# Altium schematic sheet Decoup_Cap 1.SchDoc
size A
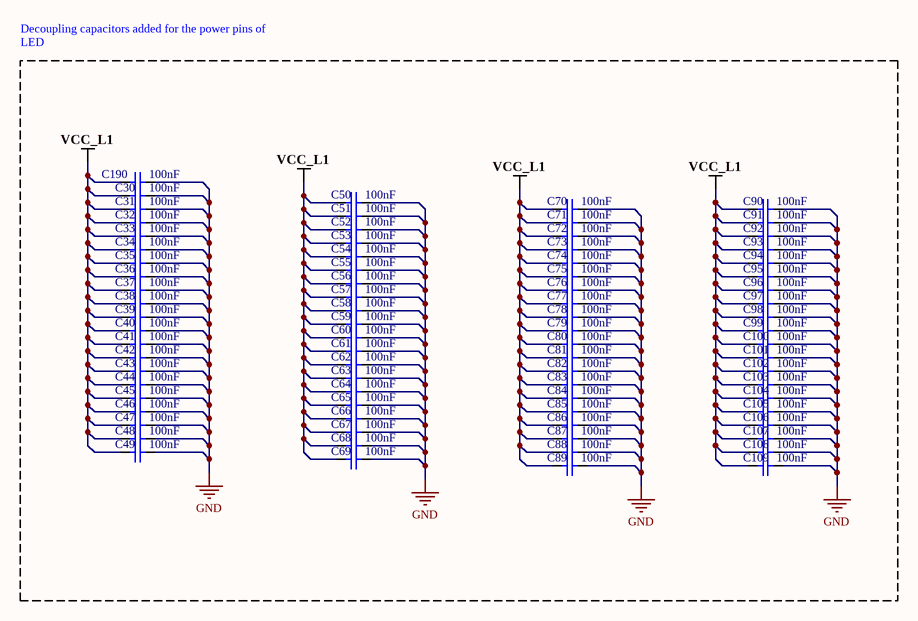
[diagram p0: Decoup_Cap 1.SchDoc]

## Parts
C30  100nF  [Cap0402]
C31  100nF  [Cap0402]
C32  100nF  [Cap0402]
C33  100nF  [Cap0402]
C34  100nF  [Cap0402]
C35  100nF  [Cap0402]
C36  100nF  [Cap0402]
C37  100nF  [Cap0402]
C38  100nF  [Cap0402]
C39  100nF  [Cap0402]
C40  100nF  [Cap0402]
C41  100nF  [Cap0402]
C42  100nF  [Cap0402]
C43  100nF  [Cap0402]
C44  100nF  [Cap0402]
C45  100nF  [Cap0402]
C46  100nF  [Cap0402]
C47  100nF  [Cap0402]
C48  100nF  [Cap0402]
C49  100nF  [Cap0402]
C50  100nF  [Cap0402]
C51  100nF  [Cap0402]
C52  100nF  [Cap0402]
C53  100nF  [Cap0402]
C54  100nF  [Cap0402]
C55  100nF  [Cap0402]
C56  100nF  [Cap0402]
C57  100nF  [Cap0402]
C58  100nF  [Cap0402]
C59  100nF  [Cap0402]
C60  100nF  [Cap0402]
C61  100nF  [Cap0402]
C62  100nF  [Cap0402]
C63  100nF  [Cap0402]
C64  100nF  [Cap0402]
C65  100nF  [Cap0402]
C66  100nF  [Cap0402]
C67  100nF  [Cap0402]
C68  100nF  [Cap0402]
C69  100nF  [Cap0402]
C70  100nF  [Cap0402]
C71  100nF  [Cap0402]
C72  100nF  [Cap0402]
C73  100nF  [Cap0402]
C74  100nF  [Cap0402]
C75  100nF  [Cap0402]
C76  100nF  [Cap0402]
C77  100nF  [Cap0402]
C78  100nF  [Cap0402]
C79  100nF  [Cap0402]
C80  100nF  [Cap0402]
C81  100nF  [Cap0402]
C82  100nF  [Cap0402]
C83  100nF  [Cap0402]
C84  100nF  [Cap0402]
C85  100nF  [Cap0402]
C86  100nF  [Cap0402]
C87  100nF  [Cap0402]
C88  100nF  [Cap0402]
C89  100nF  [Cap0402]
C90  100nF  [Cap0402]
C91  100nF  [Cap0402]
C92  100nF  [Cap0402]
C93  100nF  [Cap0402]
C94  100nF  [Cap0402]
C95  100nF  [Cap0402]
C96  100nF  [Cap0402]
C97  100nF  [Cap0402]
C98  100nF  [Cap0402]
C99  100nF  [Cap0402]
C100  100nF  [Cap0402]
C101  100nF  [Cap0402]
C102  100nF  [Cap0402]
C103  100nF  [Cap0402]
C104  100nF  [Cap0402]
C105  100nF  [Cap0402]
C106  100nF  [Cap0402]
C107  100nF  [Cap0402]
C108  100nF  [Cap0402]
C109  100nF  [Cap0402]
C190  100nF  [Cap0402]

## Nets
GND: C30.1 C31.1 C32.1 C33.1 C34.1 C35.1 C36.1 C37.1 C38.1 C39.1 C40.1 C41.1 C42.1 C43.1 C44.1 C45.1 C46.1 C47.1 C48.1 C49.1 C50.1 C51.1 C52.1 C53.1 C54.1 C55.1 C56.1 C57.1 C58.1 C59.1 C60.1 C61.1 C62.1 C63.1 C64.1 C65.1 C66.1 C67.1 C68.1 C69.1 C70.1 C71.1 C72.1 C73.1 C74.1 C75.1 C76.1 C77.1 C78.1 C79.1 C80.1 C81.1 C82.1 C83.1 C84.1 C85.1 C86.1 C87.1 C88.1 C89.1 C90.1 C91.1 C92.1 C93.1 C94.1 C95.1 C96.1 C97.1 C98.1 C99.1 C100.1 C101.1 C102.1 C103.1 C104.1 C105.1 C106.1 C107.1 C108.1 C109.1 C190.1
VCC_L1: C30.2 C31.2 C32.2 C33.2 C34.2 C35.2 C36.2 C37.2 C38.2 C39.2 C40.2 C41.2 C42.2 C43.2 C44.2 C45.2 C46.2 C47.2 C48.2 C49.2 C50.2 C51.2 C52.2 C53.2 C54.2 C55.2 C56.2 C57.2 C58.2 C59.2 C60.2 C61.2 C62.2 C63.2 C64.2 C65.2 C66.2 C67.2 C68.2 C69.2 C70.2 C71.2 C72.2 C73.2 C74.2 C75.2 C76.2 C77.2 C78.2 C79.2 C80.2 C81.2 C82.2 C83.2 C84.2 C85.2 C86.2 C87.2 C88.2 C89.2 C90.2 C91.2 C92.2 C93.2 C94.2 C95.2 C96.2 C97.2 C98.2 C99.2 C100.2 C101.2 C102.2 C103.2 C104.2 C105.2 C106.2 C107.2 C108.2 C109.2 C190.2

## Notes on the sheet
- Decoupling capacitors added for the power pins of LED

## Library data of the parts
C30-C109 C190 = CC0402KRX7R8BB104: CAP CER 0.1UF 25V X7R 0402; Manufacturer: Yageo; Tolerance: 10%; Dissipation Factor: 3.5%; Supplier 1: Digi-Key; Manufacturer Part Number: CC0402KRX7R8BB104; RoHS: Yes; Category: Ceramic Capacitors; Stock 1: 1841009; Pricing 1: 1=0.10000, 10=0.03100, 50=0.01700, 100=0.01390, 500=0.00990, 1000=0.00777, 2500=0.00707, 5000=0.00650 (USD); Mount: Surface Mount; Case/Package: 0402; Case Code (Imperial): 0402; Case Code (Metric): 1005; Min Operating Temperature: -55°C; Max Operating Temperature: 125°C; Capacitance: 100nF; Dielectric: X7R; Voltage Rating: 25V; Voltage Rating (DC): 25V; Packaging: Tape and Reel; Termination: SMD/SMT; Resistor Type: Ceramic; Length: 1mm; Width: 0.02inch; Height: 0.5mm; Thickness: 0.022inch; Depth: 0.5mm; Radiation Hardening: No; Lead Free: Lead Free; Halogen Free: Halogen Free; ComponentLink1URL: https://datasheet.ciiva.com/11464/upy-gphc-x7r-6-3v-to-50v-8-11464889.pdf?src-supplier=Avnet; ComponentLink1Description: https://datasheet.ciiva.com/11464/upy-gphc-x7r-6-3v-to-50v-8-11464889.pdf?src-supplier=Avnet; ComponentLink2URL: https://datasheet.ciiva.com/13210/upy-gphc-x7r-6-3v-to-50v-8-12304-13210908.pdf?src-supplier=Mouser; ComponentLink2Description: https://datasheet.ciiva.com/13210/upy-gphc-x7r-6-3v-to-50v-8-12304-13210908.pdf?src-supplier=Mouser; ComponentLink3URL: https://datasheet.ciiva.com/17437/upy-gphc-x7r-6-3v-to-50v-8-17437357.pdf?src-supplier=Avnet+Europe; ComponentLink3Description: https://datasheet.ciiva.com/17437/upy-gphc-x7r-6-3v-to-50v-8-17437357.pdf?src-supplier=Avnet+Europe; Supplier Part Number 1: 311-2077-1-ND